# Altium schematic sheet Schematic_File.SchDoc
size A; SheetNumber: 1; SheetTotal: 1
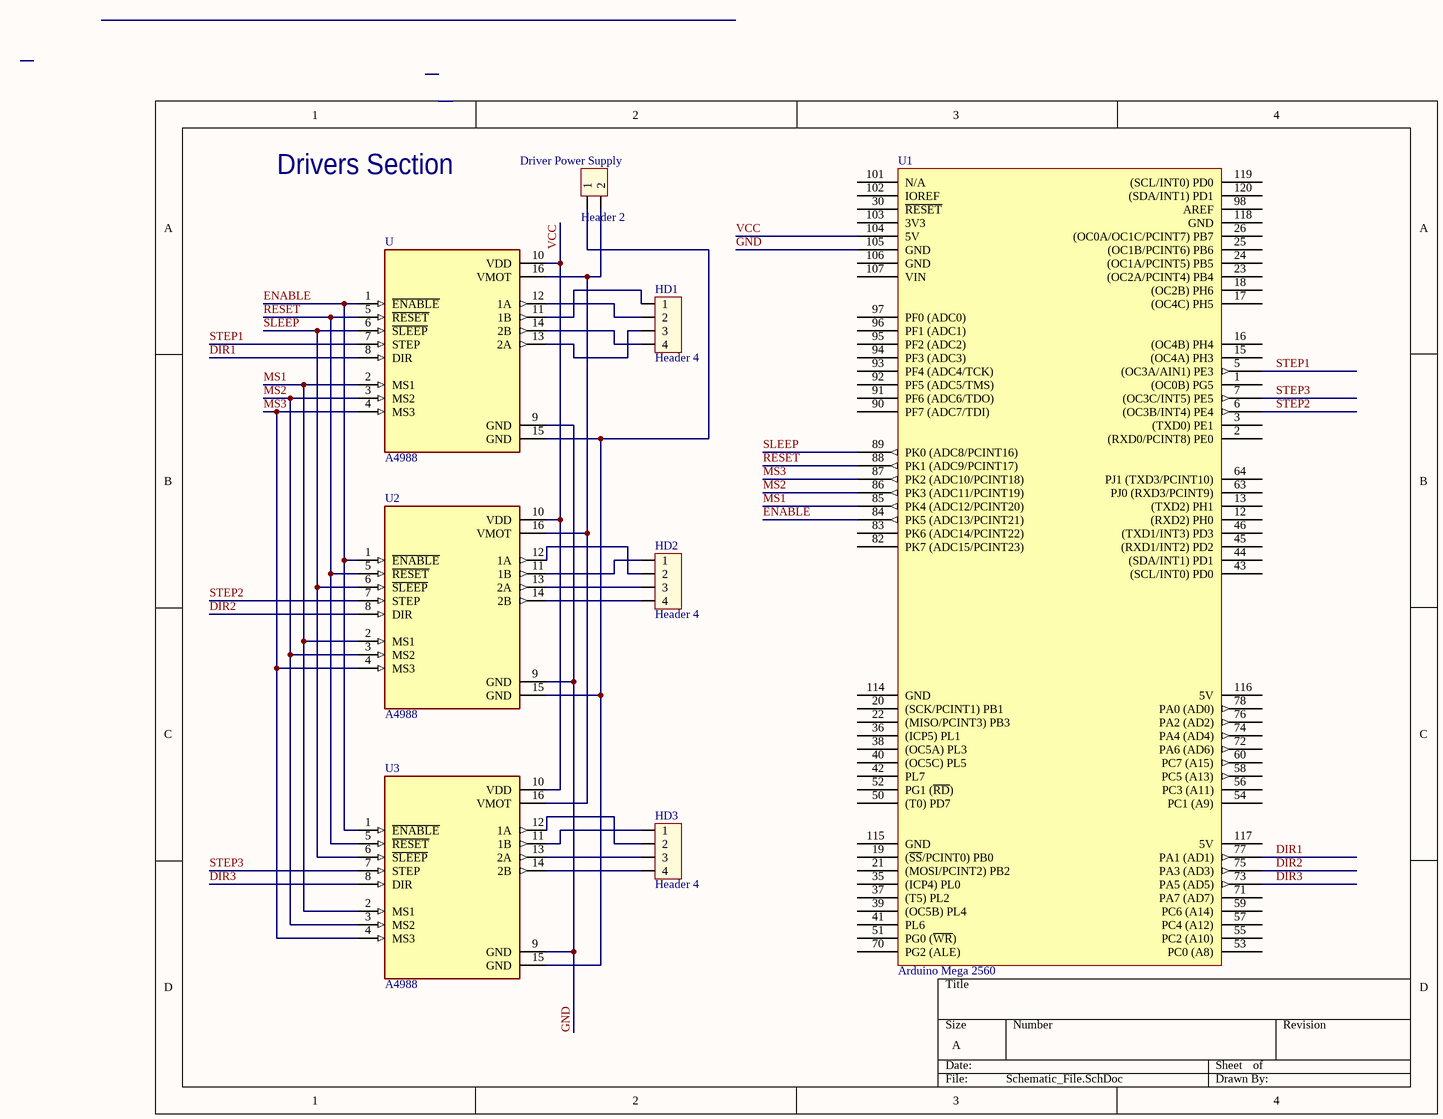
[diagram p0: Schematic_File.SchDoc]

## Parts
Driver_Power_Supply  Header 2  [HED2]
HD1  Header 4  [HED4]
HD2  Header 4  [HED4]
HD3  Header 4  [HED4]
U  A4988  [MODULE_A4988_STEPPER_MOTOR_DRIVER_CARRIER_BLACK]
U1  Arduino Mega 2560  [ARDUINO_MEGA_2560_03]
U2  A4988  [MODULE_A4988_STEPPER_MOTOR_DRIVER_CARRIER_BLACK]
U3  A4988  [MODULE_A4988_STEPPER_MOTOR_DRIVER_CARRIER_BLACK]

## Nets
DIR1: U.8(DIR) U1.77(PA1_(AD1))
DIR2: U1.75(PA3_(AD3)) U2.8(DIR)
DIR3: U1.73(PA5_(AD5)) U3.8(DIR)
ENABLE: U.1(~{ENABLE}) U1.84(PK5_(ADC13/PCINT21)) U2.1(~{ENABLE}) U3.1(~{ENABLE})
GND: U.9(GND) U1.105(GND) U2.9(GND) U3.9(GND)
MS1: U.2(MS1) U1.85(PK4_(ADC12/PCINT20)) U2.2(MS1) U3.2(MS1)
MS2: U.3(MS2) U1.86(PK3_(ADC11/PCINT19)) U2.3(MS2) U3.3(MS2)
MS3: U.4(MS3) U1.87(PK2_(ADC10/PCINT18)) U2.4(MS3) U3.4(MS3)
RESET: U.5(~{RESET}) U1.88(PK1_(ADC9/PCINT17)) U2.5(~{RESET}) U3.5(~{RESET})
SLEEP: U.6(~{SLEEP}) U1.89(PK0_(ADC8/PCINT16)) U2.6(~{SLEEP}) U3.6(~{SLEEP})
STEP1: U.7(STEP) U1.5((OC3A/AIN1)_PE3)
STEP2: U1.6((OC3B/INT4)_PE4) U2.7(STEP)
STEP3: U1.7((OC3C/INT5)_PE5) U3.7(STEP)
VCC: U.10(VDD) U1.104(5V) U2.10(VDD) U3.10(VDD)
NetDriver_Power_Supply_1: Driver_Power_Supply.1 U.15(GND) U2.15(GND) U3.15(GND)
NetDriver_Power_Supply_2: Driver_Power_Supply.2 U.16(VMOT) U2.16(VMOT) U3.16(VMOT)
NetHD1_1: HD1.1 U.11(1B)
NetHD1_2: HD1.2 U.12(1A)
NetHD1_3: HD1.3 U.13(2A)
NetHD1_4: HD1.4 U.14(2B)
NetHD2_1: HD2.1 U2.11(1B)
NetHD2_2: HD2.2 U2.12(1A)
NetHD2_3: HD2.3 U2.13(2A)
NetHD2_4: HD2.4 U2.14(2B)
NetHD3_1: HD3.1 U3.11(1B)
NetHD3_2: HD3.2 U3.12(1A)
NetHD3_3: HD3.3 U3.13(2A)
NetHD3_4: HD3.4 U3.14(2B)

Not connected (* = marked no-connect by the designer): U1 1((OC0B)_PG5) 2((RXD0/PCINT8)_PE0) 3((TXD0)_PE1) 12((RXD2)_PH0) 13((TXD2)_PH1) 15((OC4A)_PH3) 16((OC4B)_PH4) 17((OC4C)_PH5) 18((OC2B)_PH6) 19((~{SS}/PCINT0)_PB0) 20((SCK/PCINT1)_PB1) 21((MOSI/PCINT2)_PB2) 22((MISO/PCINT3)_PB3) 23((OC2A/PCINT4)_PB4) 24((OC1A/PCINT5)_PB5) 25((OC1B/PCINT6)_PB6) 26((OC0A/OC1C/PCINT7)_PB7) 30(~{RESET}) 35((ICP4)_PL0) 36((ICP5)_PL1) 37((T5)_PL2) 38((OC5A)_PL3) 39((OC5B)_PL4) 40((OC5C)_PL5) 41(PL6) 42(PL7) 43((SCL/INT0)_PD0) 44((SDA/INT1)_PD1) 45((RXD1/INT2)_PD2) 46((TXD1/INT3)_PD3) 50((T0)_PD7) 51(PG0_(~{WR})) 52(PG1_(~{RD})) 53(PC0_(A8)) 54(PC1_(A9)) 55(PC2_(A10)) 56(PC3_(A11)) 57(PC4_(A12)) 58(PC5_(A13)) 59(PC6_(A14)) 60(PC7_(A15)) 63(PJ0_(RXD3/PCINT9)) 64(PJ1_(TXD3/PCINT10)) 70(PG2_(ALE)) 71(PA7_(AD7)) 72(PA6_(AD6)) 74(PA4_(AD4)) 76(PA2_(AD2)) 78(PA0_(AD0)) 82(PK7_(ADC15/PCINT23)) 83(PK6_(ADC14/PCINT22)) 90(PF7_(ADC7/TDI)) 91(PF6_(ADC6/TDO)) 92(PF5_(ADC5/TMS)) 93(PF4_(ADC4/TCK)) 94(PF3_(ADC3)) 95(PF2_(ADC2)) 96(PF1_(ADC1)) 97(PF0_(ADC0)) 98(AREF) 101(N/A) 102(IOREF) 103(3V3) 106(GND) 107(VIN) 114(GND) 115(GND) 116(5V) 117(5V) 118(GND) 119((SCL/INT0)_PD0) 120((SDA/INT1)_PD1)

## Notes on the sheet
- Drivers Section

## Library data of the parts
Driver_Power_Supply = Hed2: Header 2 (Green); Value: Header 2
HD1-HD3 = Hed4: Header 4 (Green); Value: Header 4
U U2 U3 = A4988_STEPPER_MOTOR_DRIVER_CARRIER_BLACK: Stepper motor controler; IC: A4988; 1.2A; Uin mot: 8Ã·35V; MF: Pololu; MP: A4988 STEPPER MOTOR DRIVER CARRIER BLACK; SnapEDA_Link: https://www.snapeda.com/parts/A4988%20STEPPER%20MOTOR%20DRIVER%20CARRIER%20BLACK/Pololu/view-part/1450050/?ref=snap; Value: *; Availability: Unavailable; Price: None; Package: None
U1 = Arduino Mega 2560_03: Published: 30-May-2008; DatasheetVersion: rev6, Mar-2008; PackageVersion: Mar-2008; PackageReference: LQFP100; Publisher: Altium Limited; PackageDescription: 100-Pin Low-Profile Quad Flat Pack, 14 x 14 mm Body, 0.5 mm Pitch (LQFP100); ComponentLink1Description: Manufacturer Link; ComponentLink1URL: www.st.com/stm32; ComponentLink2Description: Datasheet; ComponentLink2URL: http://www.st.com/stonline/products/literature/ds/13587.pdf